# Altium schematic sheet ST25DV.SchDoc
size A4; SheetNumber: 1; SheetTotal: 1
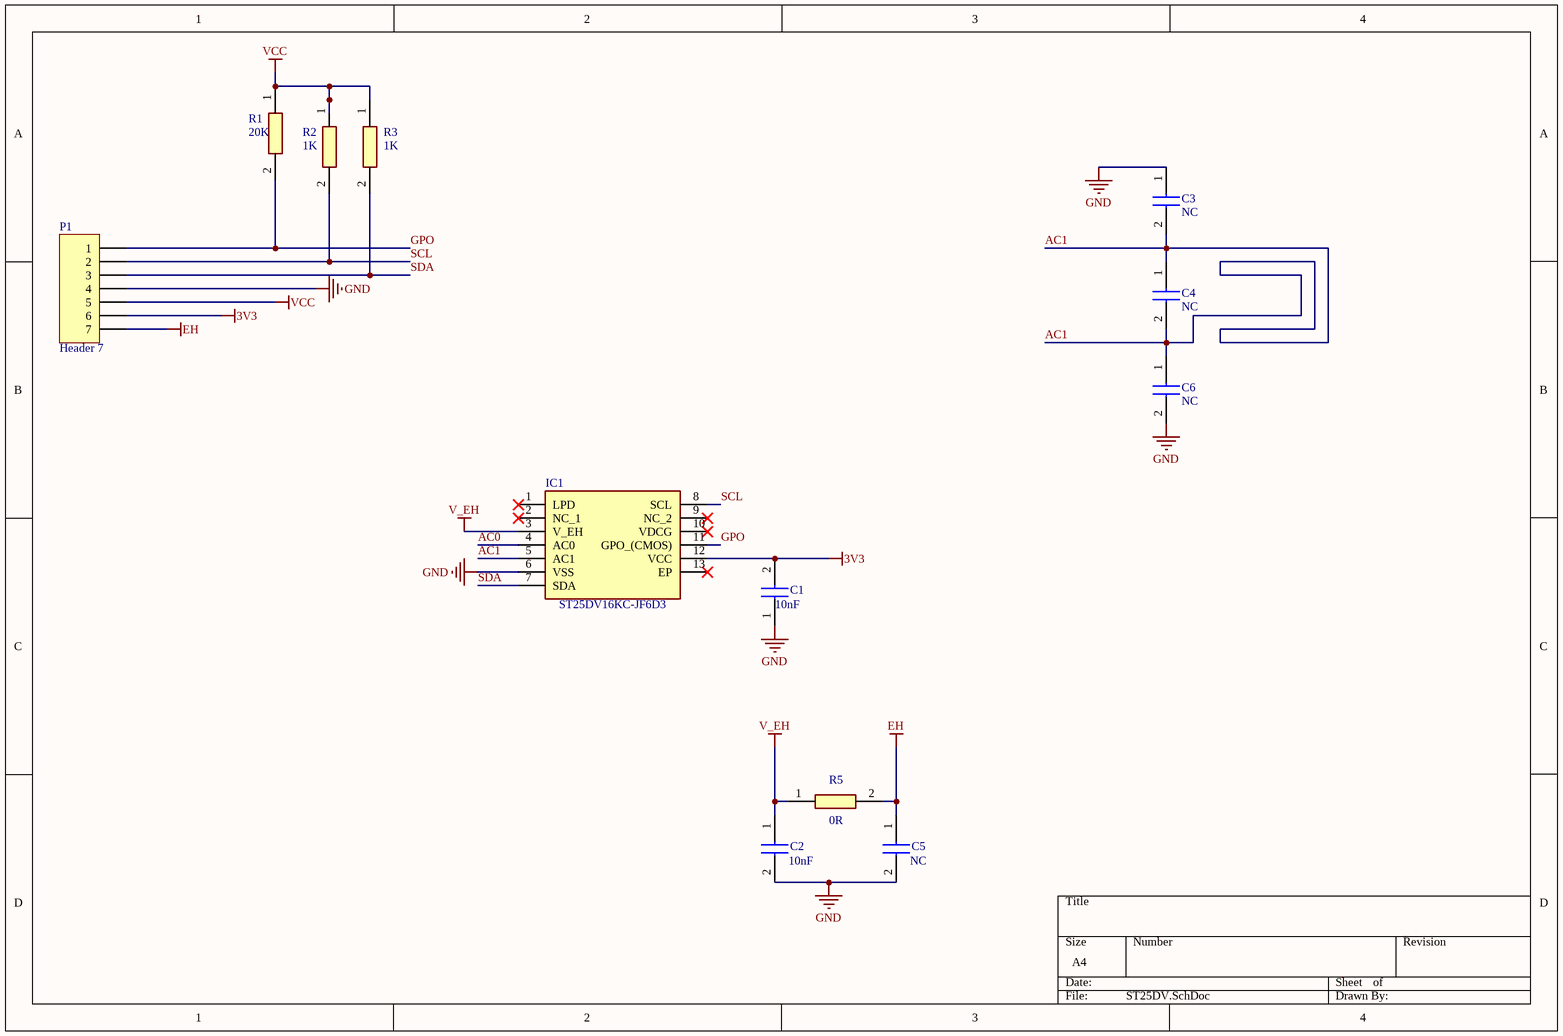
[diagram p0: ST25DV.SchDoc]

## Parts
C1  10nF  [CAPC1005X60N]
C2  10nF  [CAPC1005X60N]
C3  NC  [CAPC1005X60N]
C4  NC  [CAPC1005X60N]
C5  NC  [CAPC1005X60N]
C6  NC  [CAPC1005X60N]
IC1  ST25DV16KC-JF6D3  [ST25DV64KCJF6D3]
P1  Header 7  [HDR1X7]
R1  20K  [CRCW0402200KFKED]
R2  1K  [CRCW0402200KFKED]
R3  1K  [CRCW0402200KFKED]
R5  0R  [CRCW0402200KFKED]

## Nets
3V3: C1.2 IC1.12(VCC) P1.6
EH: C5.1 P1.7 R5.2
GND: C1.1 C2.2 C3.1 C5.2 C6.2 IC1.6(VSS) P1.4
V_EH: C2.1 IC1.3(V_EH) R5.1
VCC: P1.5 R1.1 R2.1 R3.1
AC0: IC1.4(AC0)
AC1: C3.2 C4.1 C4.2 C6.1 IC1.5(AC1)
GPO: IC1.11(GPO_(CMOS)) P1.1 R1.2
SCL: IC1.8(SCL) P1.2 R2.2
SDA: IC1.7(SDA) P1.3 R3.2

Not connected (* = marked no-connect by the designer): IC1 1(LPD)* 2(NC_1)* 9(NC_2)* 10(VDCG)* 13(EP)*

## Library data of the parts
C1-C6 = VJ0402Y103KXAAC: Capacitor; Manufacturer_Name: Vishay; Datasheet Link: https://www.vishay.com/docs/45199/vjcommercialseries.pdf; Height: 0.6mm; Manufacturer_Part_Number: VJ0402Y103KXAAC; Mouser Part Number: 77-VJ0402Y103KXAAC; Mouser Price/Stock: https://www.mouser.co.uk/ProductDetail/Vishay-Vitramon/VJ0402Y103KXAAC?qs=e%2F7vlcXyL81c3K8Dz3L1zQ%3D%3D
IC1 = ST25DV16KC-JF6D3: Integrated Circuit; Manufacturer_Name: STMicroelectronics; Datasheet Link: https://www.st.com/resource/en/datasheet/st25dv04kc.pdf; Height: 0.6mm; Manufacturer_Part_Number: ST25DV16KC-JF6D3; Mouser Part Number: 511-ST25DV16KC-JF6D3; Mouser Price/Stock: https://www.mouser.co.uk/ProductDetail/STMicroelectronics/ST25DV16KC-JF6D3?qs=QNEnbhJQKvagGd4c%252BMJmeA%3D%3D
P1 = Header 7: Header, 7-Pin; LatestRevisionDate: 17-Jul-2002; LatestRevisionNote: Re-released for DXP Platform.; Publisher: Altium Limited
R1-R3 R5 = CRCW04021K65FKEE: Resistor; Manufacturer_Name: Vishay; Datasheet Link: http://www.vishay.com/docs/20035/dcrcwe3.pdf; Height: 0.4mm; Manufacturer_Part_Number: CRCW04021K65FKEE